# Altium schematic sheet Ctrl-CAN.SchDoc: SPI to CAN Controller/Transeiver
size Letter; ApprovedBy: k.cotton; Engineer: K.Cotton; Organization: Cegep Limoilou; Address1: 1300, 8e Avenue; Address2: Québec, QC; Address3: Canada; Address4: G1J 5L5; SheetNumber: 3; SheetTotal: 5
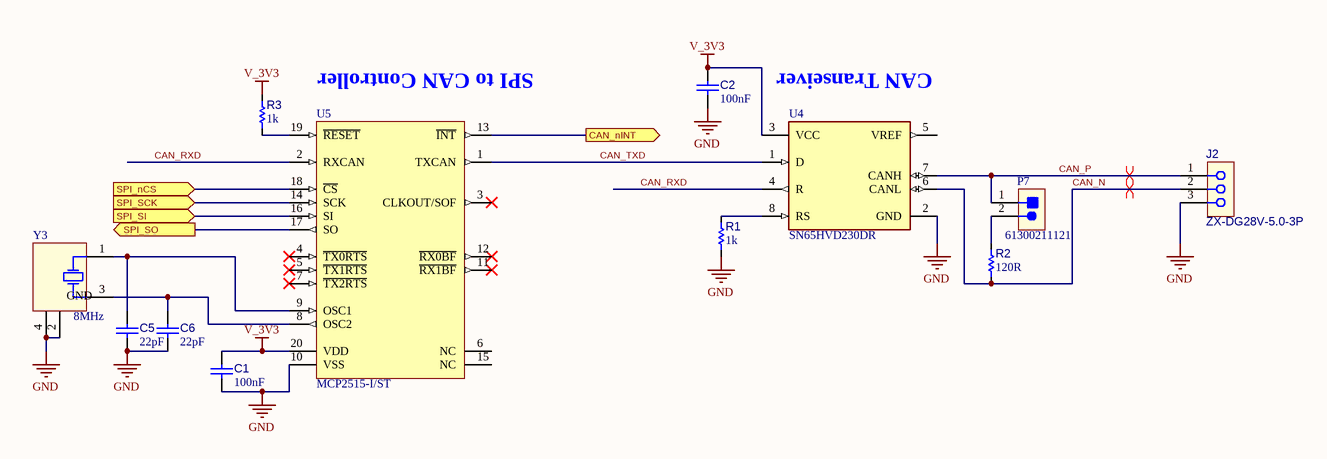
[diagram p0: Ctrl-CAN.SchDoc]

## Parts
C1  value 100nF  [C_1005[0402]]  (hidden comment: CAP CER 100nF 50V 0402)
C2  value 100nF  [C_1005[0402]]  (hidden comment: CAP CER 100nF 50V 0402)
C5  value 22pF  [C_1005[0402]]  (hidden comment: CAP CER 22pF 50V COG 0402)
C6  value 22pF  [C_1005[0402]]  (hidden comment: CAP CER 22pF 50V COG 0402)
J2  ZX-DG28V-5.0-3P  [CONN_TERM_BLOCK_3POS_5mm_Model1]
P7  61300211121  [CONN_HDR_2POS_100MILS_TH]
R1  value 1k  [R_1005[0402]]  (hidden comment: Res 1k 1% 0402)
R2  value 120R  [R_3216[1206]]  (hidden comment: Res 120R 1% 1206)
R3  value 1k  [R_1005[0402]]  (hidden comment: Res 1k 1% 0402)
U4  SN65HVD230DR  [FP-D0008A-IPC_A]
U5  MCP2515-I/ST  [TSSOP-ST20_N]
Y3  value 8MHz  [Y_32x25SMD4]  (hidden comment: XC32M4-8.000-F18LJDT)

## Ports
CAN_nINT (out, see 243-5xx_Pi-CAN-PWM[3B]), SPI_nCS (in, see 243-5xx_Pi-CAN-PWM[3B], Pi5-Interface[3C]), SPI_SCK (in, see 243-5xx_Pi-CAN-PWM[3B], Pi5-Interface[1C]), SPI_SI (in, see 243-5xx_Pi-CAN-PWM[3B], Pi5-Interface[1C]), SPI_SO (out, see 243-5xx_Pi-CAN-PWM[3B], Pi5-Interface[1C])

## Nets
GND: C1.1 C2.1 C5.1 C6.1 J2.3 R1.1 U4.2(GND) U5.10(VSS) Y3.2(GND) Y3.4(GND)
V_3V3: C1.2 C2.2 R3.2 U4.3(VCC) U5.20(VDD)
CAN_N: J2.2 R2.1 U4.6(CANL)
CAN_nINT: U5.13(~{INT}) ; port CAN_nINT
CAN_P: J2.1 P7.1 U4.7(CANH)
CAN_RXD: U4.4(R) U5.2(RXCAN)
CAN_TXD: U4.1(D) U5.1(TXCAN)
SPI_nCS: U5.18(~{CS}) ; port SPI_nCS
SPI_SCK: U5.14(SCK) ; port SPI_SCK
SPI_SI: U5.16(SI) ; port SPI_SI
SPI_SO: U5.17(SO) ; port SPI_SO
NetC5_2: C5.2 U5.9(OSC1) Y3.1(XTAL)
NetC6_2: C6.2 U5.8(OSC2) Y3.3(XTAL)
NetP7_2: P7.2 R2.2
NetR1_2: R1.2 U4.8(RS)
NetR3_1: R3.1 U5.19(~{RESET})

Not connected (* = marked no-connect by the designer): U4 5(VREF); U5 3(CLKOUT/SOF)* 4(~{TX0RTS})* 5(~{TX1RTS})* 6(NC) 7(~{TX2RTS})* 11(~{RX1BF})* 12(~{RX0BF})* 15(NC)

## Layout directives
differential pair: CAN_N, CAN_P

## Notes on the sheet
- SPI to CAN Controller
- (near U4) CAN Transeiver
- Titre :
- Conception :
- Date :
- Approbation :
- Heure :
- Révision :
- Feuille
- de
- Fichier :

## Library data of the parts
C1 C2 = CAP001: Capacitor type 1; Manufacturer 1: Yageo; Manufacturer Part Number 1: CC0402KRX7R9BB104; LibRef: CAP001; Code CEGEP: KCOND01SM; Tolerance: 10%; Dielectric: X7R; Rated Voltage: 50V; Mounting Technology: SMT; Supplier 1: LCSC; Supplier Part Number 1: C131394
C5 C6 = CAP010: Capacitor type 1; Manufacturer 1: Yageo; Manufacturer Part Number 1: CC0402JRNPO9BN220; LibRef: CAP010; Tolerance: 5%; Dielectric: C0G; Rated Voltage: 50V; Mounting Technology: SMT; Supplier 1: LCSC; Supplier Part Number 1: C106203
J2 = CONN-5MM-3POS-TERM-BLOCK: CONN TERM BLOCK 3POS 5mm pitch; Manufacturer 1: Megastar; Code CEGEP: CONWECO0003 / KCONWECO0030; Localisation: / R13-E102; Supplier 1: LCSC; Supplier Part Number 1: ZX-DG28V-5.0-3P; Manufacturer Part Number 1: ZX-DG28V-5.0-3P; Mounting Technology: TH; Manufacturer 2: Weco - Phoenix Contact; Manufacturer Part Number 2: 950-DS/03 - 1890976
P7 = CONN-100MIL-HDR-01X02: CONN HEADER 2POS 100MIL; Manufacturer 1: Megastar; Manufacturer Part Number 1: ZX-PZ2.54-1-2PZZ; Mounting Technology: TH; Supplier 1: LCSC; Supplier Part Number 1: C7501260; Manufacturer 2: Würth Elektronik; Manufacturer Part Number 2: 61300211121
R1 R3 = RES006: Resistor type 1; Manufacturer 1: Yageo; Manufacturer Part Number 1: RC0402FR-071kL; LibRef: RES006; Code CEGEP: RES1KSM; Puissance: 1/16W; Max Working Voltage: 50V; Tolerance: 1%; Mounting Technology: SMT; Supplier 1: LCSC; Supplier Part Number 1: C106235
R2 = RES014: Resistor type 1; Manufacturer 1: Yageo; Manufacturer Part Number 1: RC1206FR-07120RL; LibRef: RES014; Code CEGEP: RESI0043SMT; Puissance: 1/4W; Max Working Voltage: 200V; Tolerance: 1%; Mounting Technology: SMT; Supplier 1: LCSC; Supplier Part Number 1: C114928; Supplier 2: Digikey; Supplier Part Number 2: P120ECT-ND
U4 = CMP-0315-00015-3: IC TRANSCEIVER HALF 1/1 8SOIC; Number of Transceivers: 1; Operating Supply Voltage: 3.3V; Number of I/Os: 2; Max Supply Current: 17mA; Max Supply Voltage: 3.6V; Min Supply Voltage: 3V; Data Rate: 1Mbps; Min Operating Temperature: -40°C; Packaging: Tape and Reel; Lead Free: Lead Free; Number of Transmit Buffers: 1; Max Operating Temperature: 85°C; Number of Receive Buffers: 1; Number of Pins: 8; Package Quantity: 1; Radiation Hardening: No; Case/Package: D; REACH SVHC: No SVHC; Weight: 0.002561oz; Termination: SMD/SMT; Contact Plating: Gold; Nominal Supply Current: 17mA; Number of Receivers: 1; Number of Drivers: 1
U5 = CMP-0186-00077-2: Stand-Alone CAN Controller With SPI Interface, 20-Pin TSSOP, Industrial Temperature; DatasheetVersion: revF, Oct-2010; ComponentLink1Description: Manufacturer URL; PackageDescription: 20-Lead Plastic Thin Shrink Small Outline (ST) - 4.4mm Body [TSSOP]; ComponentLink1URL: http://www.microchip.com/; RevisionNote: URLs added. DatasheetVersion updated.; PackageReference: TSSOP-ST20; Code_JEDEC: MO-153-AC; ComponentLink2Description: Datasheet; ComponentLink2URL: http://ww1.microchip.com/downloads/en/DeviceDoc/21801f.pdf; PackageVersion: revBB, Aug-2009; ComponentLink3URL: http://www.microchip.com/stellent/groups/techpub_sg/documents/packagingspec/en012702.pdf; ComponentLink3Description: Package Specification
Y3 = Y_XTAL25MHz: Crystal, 8MHz, 3.2 x 2.5 x 0.9 mm SMD; Manufacturer 1: HCI; Technology: SMT; Part Number 1: XC32M4-8.000-F18LJDT; Supplier 1: LCSC; Supplier Part Number 1: C2905353